# Altium schematic sheet IsolatedDAC.SchDoc
size A4
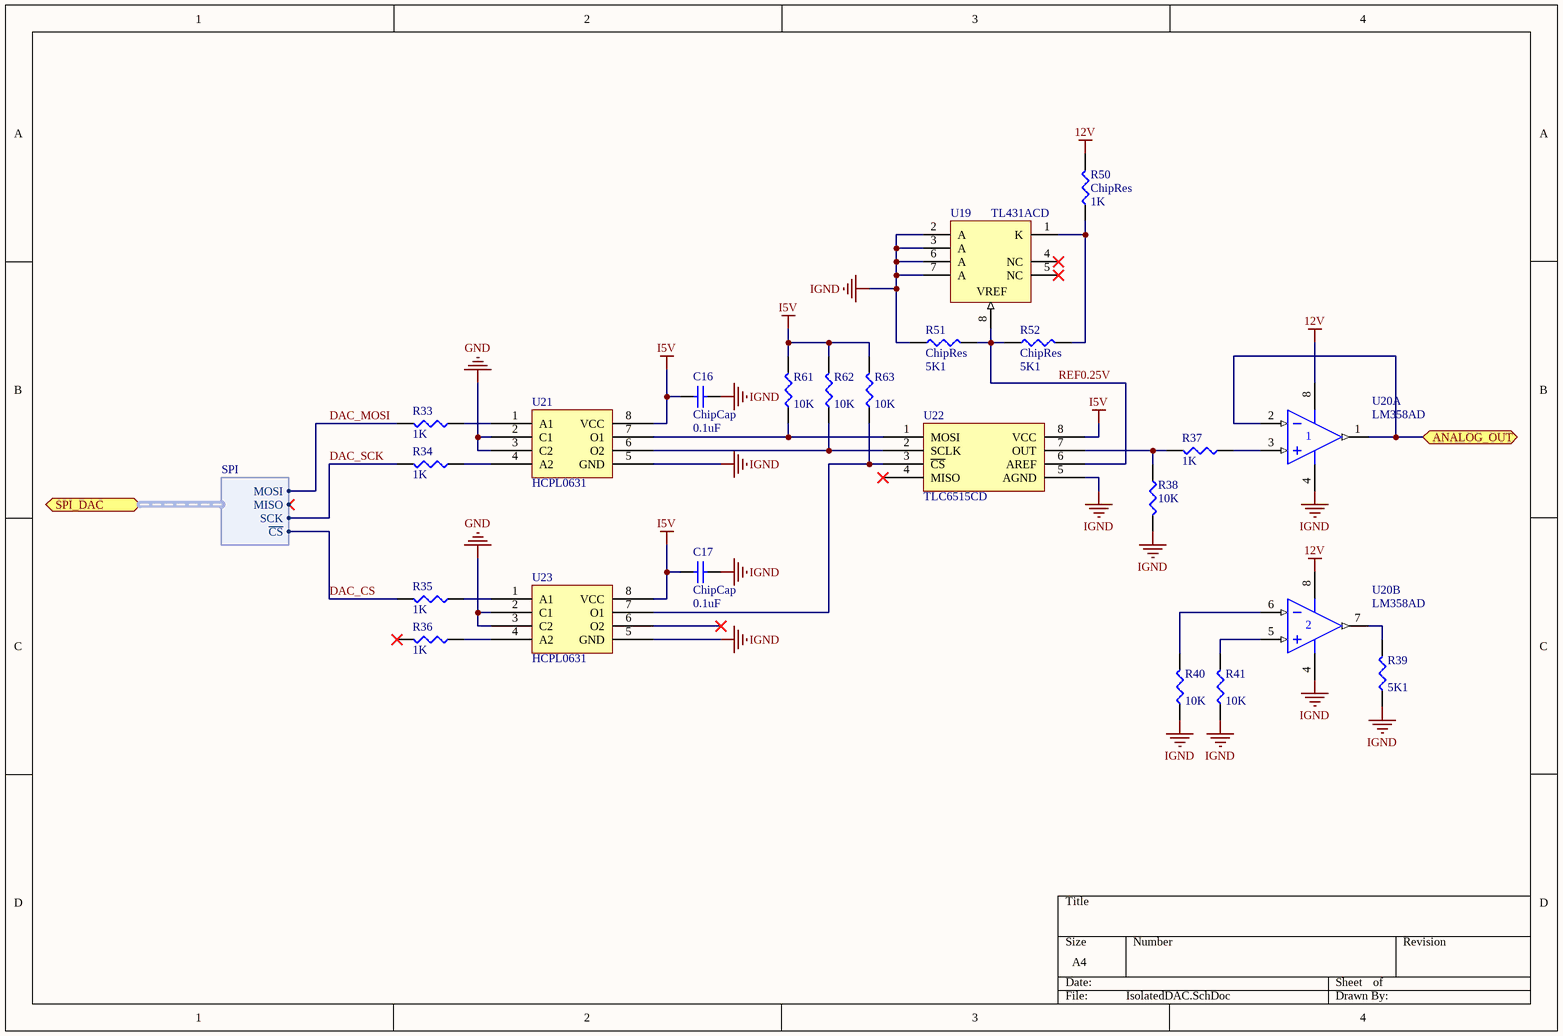
[diagram p0: IsolatedDAC.SchDoc]

## Parts
C16  ChipCap  value 0.1uF  [CAP0805]
C17  ChipCap  value 0.1uF  [CAP0805]
R33  value 1K  [RES0805]  (hidden comment: ChipRes)
R34  value 1K  [RES0805]  (hidden comment: ChipRes)
R35  value 1K  [RES0805]  (hidden comment: ChipRes)
R36  value 1K  [RES0805]  (hidden comment: ChipRes)
R37  value 1K  [RES0805]  (hidden comment: ChipRes)
R38  value 10K  [RES0805]  (hidden comment: ChipRes)
R39  value 5K1  [RES0805]  (hidden comment: ChipRes)
R40  value 10K  [RES0805]  (hidden comment: ChipRes)
R41  value 10K  [RES0805]  (hidden comment: ChipRes)
R50  ChipRes  value 1K  [RES0805]
R51  ChipRes  value 5K1  [RES0805]
R52  ChipRes  value 5K1  [RES0805]
R61  value 10K  [RES0805]  (hidden comment: ChipRes)
R62  value 10K  [RES0805]  (hidden comment: ChipRes)
R63  value 10K  [RES0805]  (hidden comment: ChipRes)
U19  TL431ACD  [D008_N]
U20  LM358AD  [D008_L]  (parts A,B of 2)
U21  HCPL0631  [SOIC8]
U22  TLC6515CD  [SOIC8]
U23  HCPL0631  [SOIC8]

## Ports
ANALOG_OUT, SPI_DAC (harness SPI)

## Harnesses
SPI: MOSI, MISO, SCK, ~{CS}

## Nets
12V: R50.2 U20.8(V+)
GND: U21.2(C1) U21.3(C2) U23.2(C1) U23.3(C2)
I5V: C16.2 C17.2 R61.2 R62.2 R63.2 U21.8(VCC) U22.8(VCC) U23.8(VCC)
IGND: C16.1 C17.1 R38.2 R39.1 R40.1 R41.1 R51.1 U19.2(A) U19.3(A) U19.6(A) U19.7(A) U20.4(V-) U21.5(GND) U22.5(AGND) U23.5(GND)
ANALOG_OUT: U20.1(OUT) U20.2(IN-) ; port ANALOG_OUT
DAC_CS: R35.2 ; port SPI_DAC.~{CS}
DAC_MOSI: R33.2 ; port SPI_DAC.MOSI
DAC_SCK: R34.2 ; port SPI_DAC.SCK
REF0.25V: R51.2 R52.1 U19.8(VREF) U22.6(AREF)
NetR33_1: R33.1 U21.1(A1)
NetR34_1: R34.1 U21.4(A2)
NetR35_1: R35.1 U23.1(A1)
NetR36_1: R36.1 U23.4(A2)
NetR37_1: R37.1 U20.3(IN+)
NetR37_2: R37.2 R38.1 U22.7(OUT)
NetR39_2: R39.2 U20.7(OUT)
NetR40_2: R40.2 U20.6(IN-)
NetR41_2: R41.2 U20.5(IN+)
NetR50_1: R50.1 R52.2 U19.1(K)
NetR61_1: R61.1 U21.7(O1) U22.1(MOSI)
NetR62_1: R62.1 U21.6(O2) U22.2(SCLK)
NetR63_1: R63.1 U22.3(~{CS}) U23.7(O1)

Not connected (* = marked no-connect by the designer): R36 2*; U19 4(NC)* 5(NC)*; U22 4(MISO)*; U23 6(O2)*

## Library data of the parts
C16 C17 = ChipCap: Capacitor; Published: 8-Jun-2000; LatestRevisionDate: 17-Jul-2002; LatestRevisionNote: Re-released for DXP Platform.; PackageReference: RAD-0.3; Publisher: Altium Limited
R33-R41 R50-R52 R61-R63 = ChipRes: Chip resistor
U19 = TL431ACD: Adjustable Precision Shunt Regulator; Published: 15-Apr-2002; LatestRevisionDate: 13-Apr-2006; LatestRevisionNote: IPC-7351 Footprint Added.; DatasheetVersion: Oct-2000; PackageVersion: Jan-1998; PackageReference: D008; Publisher: Altium Limited; PackageDescription: 8-Pin Small Outline Integrated Circuit 1.27 mm Pitch; Code_IPC: SOIC127P600-8; ComponentLink1Description: Manufacturer Link; ComponentLink1URL: http://www.ti.com/; ComponentLink2Description: Datasheet; ComponentLink2URL: http://www-s.ti.com/sc/ds/tl431a.pdf
U20 = LM358AD: Dual Operational Amplifier; Published: 15-Apr-2002; LatestRevisionDate: 13-Apr-2006; LatestRevisionNote: IPC-7351 Footprint Added.; DatasheetVersion: Aug-1988; PackageVersion: Jan-1998; PackageReference: D008; Publisher: Altium Limited; PackageDescription: 8-Pin Small Outline Integrated Circuit 1.27 mm Pitch; Code_IPC: SOIC127P600-8; ComponentLink1Description: Manufacturer Link; ComponentLink1URL: http://www.ti.com/; ComponentLink2Description: Datasheet; ComponentLink2URL: http://www-s.ti.com/sc/ds/lm358.pdf
U21 U23 = HCPL0631: 2-channel opto-coupler
U22 = TLC6515: 10-bit analog to digiyal converter; Manufacturer: Texas Instruments